# Altium schematic sheet mcu.SchDoc: MCU
size B; Organization: Altium Limited; Address1: L3, 12a Rodborough Rd; Address2: Frenchs Forest; Address3: NSW; Address4: Australia 2086; Revision: A; SheetNumber: 4; SheetTotal: 7
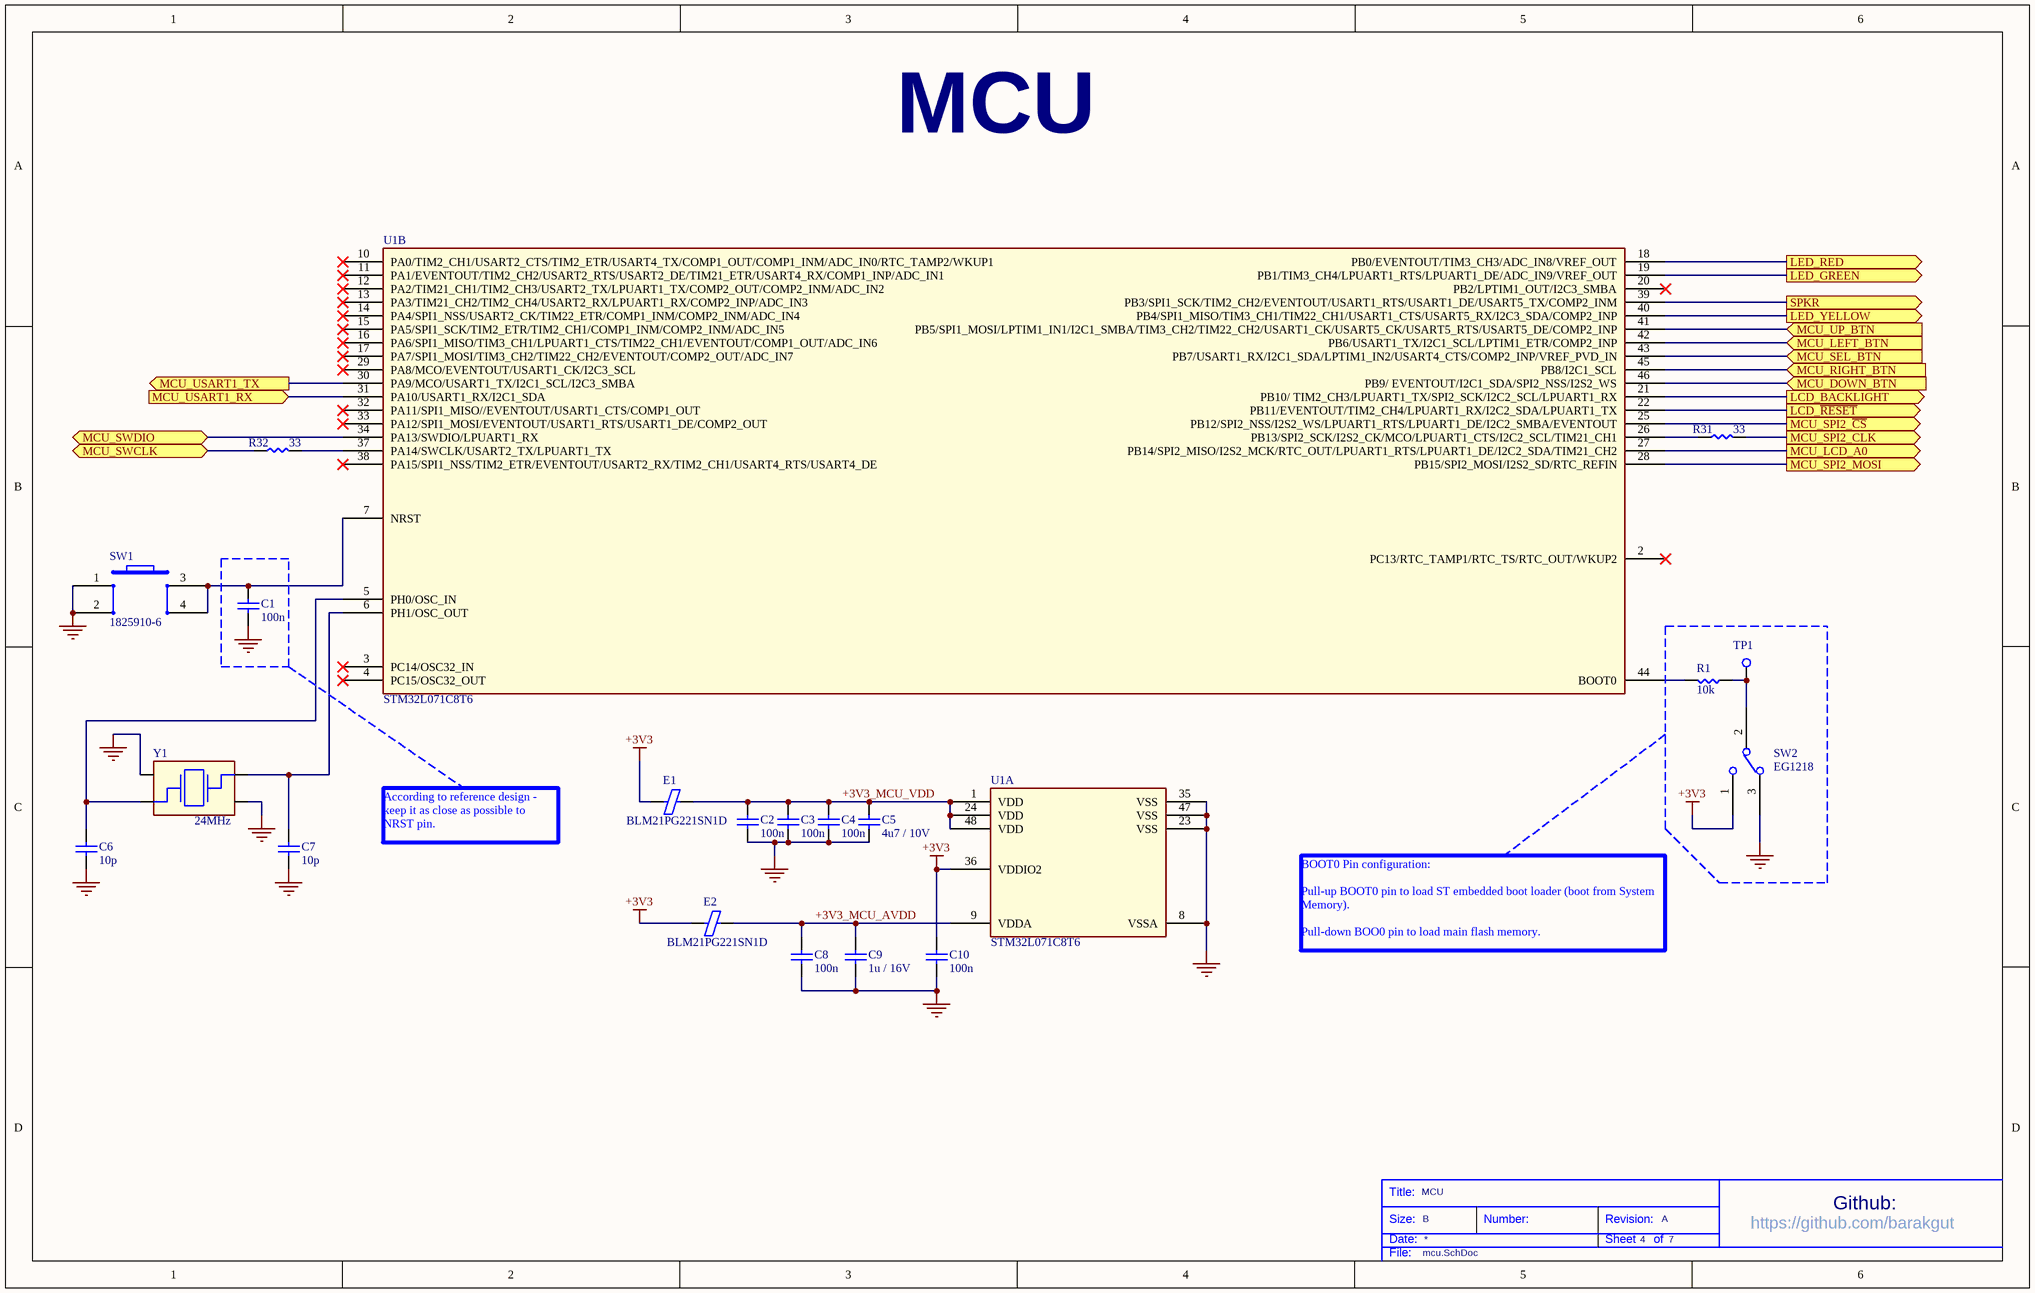
[diagram p0: mcu.SchDoc]

## Parts
C1  100n  [C0402]
C2  100n  [C0402]
C3  100n  [C0402]
C4  100n  [C0402]
C5  4u7 / 10V  [C0805]
C6  10p  [C0402]
C7  10p  [C0402]
C8  100n  [C0402]
C9  1u / 16V  [C0805]
C10  100n  [C0402]
E1  BLM21PG221SN1D  [R0805]
E2  BLM21PG221SN1D  [R0805]
R1  10k  [R0805]
R31  33  [R0402]
R32  33  [R0402]
SW1  1825910-6  [1825910-6]
SW2  EG1218  [EG1218]
TP1  Test Pad 1mm  [TP_1MM]  (value not drawn)  (no BOM)
U1  STM32L071C8T6  [LQFP48]  (parts A,B of 2)
Y1  24MHz  [ABM10AIG-24.000MHZ-4Z-T3]

## Ports
LCD_BACKLIGHT (out), LCD_~{RESET} (out), LED_GREEN (out), LED_RED (out), LED_YELLOW (out), MCU_DOWN_BTN (in), MCU_LCD_A0 (out), MCU_LEFT_BTN (in), MCU_RIGHT_BTN (in), MCU_SEL_BTN (in), MCU_SPI2_CLK (out), MCU_SPI2_MOSI (out), MCU_SPI2_~{CS} (out), MCU_SWCLK (bidir), MCU_SWDIO (bidir), MCU_UP_BTN (in), MCU_USART1_RX (in), MCU_USART1_TX (out), SPKR (out)

## Nets
+3V3: C10.2 E1.1 E2.1 SW2.1 U1.36(VDDIO2)
GND: C1.1 C2.1 C3.1 C4.1 C5.1 C6.1 C7.1 C8.1 C9.1 C10.1 SW1.1 SW1.2 SW2.3 U1.8(VSSA) U1.23(VSS) U1.35(VSS) U1.47(VSS) Y1.2 Y1.4
+3V3_MCU_AVDD: C8.2 C9.2 E2.2 U1.9(VDDA)
+3V3_MCU_VDD: C2.2 C3.2 C4.2 C5.2 E1.2 U1.1(VDD) U1.24(VDD) U1.48(VDD)
LCD_BACKLIGHT: U1.21(PB10/_TIM2_CH3/LPUART1_TX/SPI2_SCK/I2C2_SCL/LPUART1_RX) ; port LCD_BACKLIGHT
LCD_~{RESET}: U1.22(PB11/EVENTOUT/TIM2_CH4/LPUART1_RX/I2C2_SDA/LPUART1_TX) ; port LCD_~{RESET}
LED_GREEN: U1.19(PB1/TIM3_CH4/LPUART1_RTS/LPUART1_DE/ADC_IN9/VREF_OUT) ; port LED_GREEN
LED_RED: U1.18(PB0/EVENTOUT/TIM3_CH3/ADC_IN8/VREF_OUT) ; port LED_RED
LED_YELLOW: U1.40(PB4/SPI1_MISO/TIM3_CH1/TIM22_CH1/USART1_CTS/USART5_RX/I2C3_SDA/COMP2_INP) ; port LED_YELLOW
MCU_DOWN_BTN: U1.46(PB9/_EVENTOUT/I2C1_SDA/SPI2_NSS/I2S2_WS) ; port MCU_DOWN_BTN
MCU_LCD_A0: U1.27(PB14/SPI2_MISO/I2S2_MCK/RTC_OUT/LPUART1_RTS/LPUART1_DE/I2C2_SDA/TIM21_CH2) ; port MCU_LCD_A0
MCU_LEFT_BTN: U1.42(PB6/USART1_TX/I2C1_SCL/LPTIM1_ETR/COMP2_INP) ; port MCU_LEFT_BTN
MCU_RIGHT_BTN: U1.45(PB8/I2C1_SCL) ; port MCU_RIGHT_BTN
MCU_SEL_BTN: U1.43(PB7/USART1_RX/I2C1_SDA/LPTIM1_IN2/USART4_CTS/COMP2_INP/VREF_PVD_IN) ; port MCU_SEL_BTN
MCU_SPI2_~{CS}: U1.25(PB12/SPI2_NSS/I2S2_WS/LPUART1_RTS/LPUART1_DE/I2C2_SMBA/EVENTOUT) ; port MCU_SPI2_~{CS}
MCU_SPI2_CLK: R31.2 ; port MCU_SPI2_CLK
MCU_SPI2_MOSI: U1.28(PB15/SPI2_MOSI/I2S2_SD/RTC_REFIN) ; port MCU_SPI2_MOSI
MCU_SWCLK: R32.1 ; port MCU_SWCLK
MCU_SWDIO: U1.34(PA13/SWDIO/LPUART1_RX) ; port MCU_SWDIO
MCU_UP_BTN: U1.41(PB5/SPI1_MOSI/LPTIM1_IN1/I2C1_SMBA/TIM3_CH2/TIM22_CH2/USART1_CK/USART5_CK/USART5_RTS/USART5_DE/COMP2_INP) ; port MCU_UP_BTN
MCU_USART1_RX: U1.31(PA10/USART1_RX/I2C1_SDA) ; port MCU_USART1_RX
MCU_USART1_TX: U1.30(PA9/MCO/USART1_TX/I2C1_SCL/I2C3_SMBA) ; port MCU_USART1_TX
SPKR: U1.39(PB3/SPI1_SCK/TIM2_CH2/EVENTOUT/USART1_RTS/USART1_DE/USART5_TX/COMP2_INM) ; port SPKR
NetC1_2: C1.2 SW1.3 SW1.4 U1.7(NRST)
NetC6_2: C6.2 U1.5(PH0/OSC_IN) Y1.1
NetC7_2: C7.2 U1.6(PH1/OSC_OUT) Y1.3
NetR1_1: R1.1 SW2.2 TP1.1
NetR1_2: R1.2 U1.44(BOOT0)
NetR31_1: R31.1 U1.26(PB13/SPI2_SCK/I2S2_CK/MCO/LPUART1_CTS/I2C2_SCL/TIM21_CH1)
NetR32_2: R32.2 U1.37(PA14/SWCLK/USART2_TX/LPUART1_TX)

Not connected (* = marked no-connect by the designer): U1 2(PC13/RTC_TAMP1/RTC_TS/RTC_OUT/WKUP2)* 3(PC14/OSC32_IN)* 4(PC15/OSC32_OUT)* 10(PA0/TIM2_CH1/USART2_CTS/TIM2_ETR/USART4_TX/COMP1_OUT/COMP1_INM/ADC_IN0/RTC_TAMP2/WKUP1)* 11(PA1/EVENTOUT/TIM2_CH2/USART2_RTS/USART2_DE/TIM21_ETR/USART4_RX/COMP1_INP/ADC_IN1)* 12(PA2/TIM21_CH1/TIM2_CH3/USART2_TX/LPUART1_TX/COMP2_OUT/COMP2_INM/ADC_IN2)* 13(PA3/TIM21_CH2/TIM2_CH4/USART2_RX/LPUART1_RX/COMP2_INP/ADC_IN3)* 14(PA4/SPI1_NSS/USART2_CK/TIM22_ETR/COMP1_INM/COMP2_INM/ADC_IN4)* 15(PA5/SPI1_SCK/TIM2_ETR/TIM2_CH1/COMP1_INM/COMP2_INM/ADC_IN5)* 16(PA6/SPI1_MISO/TIM3_CH1/LPUART1_CTS/TIM22_CH1/EVENTOUT/COMP1_OUT/ADC_IN6)* 17(PA7/SPI1_MOSI/TIM3_CH2/TIM22_CH2/EVENTOUT/COMP2_OUT/ADC_IN7)* 20(PB2/LPTIM1_OUT/I2C3_SMBA)* 29(PA8/MCO/EVENTOUT/USART1_CK/I2C3_SCL)* 32(PA11/SPI1_MISO//EVENTOUT/USART1_CTS/COMP1_OUT)* 33(PA12/SPI1_MOSI/EVENTOUT/USART1_RTS/USART1_DE/COMP2_OUT)* 38(PA15/SPI1_NSS/TIM2_ETR/EVENTOUT/USART2_RX/TIM2_CH1/USART4_RTS/USART4_DE)*

## Notes on the sheet
- MCU
- According to reference design - keep it as close as possible to NRST pin.
- BOOT0 Pin configuration:
  Pull-up BOOT0 pin to load ST embedded boot loader (boot from System Memory).
  Pull-down BOO0 pin to load main flash memory.
- Title:
- Size:
- Date:
- B
- Number:
- Revision:
- Sheet
- of
- https://github.com/barakgut
- Github:
- File:

## Library data of the parts
C1-C4 C8 C10 = CGA2B3X7R1E104K050BB: TDK         CGA2B3X7R1E104K050BB             SMD Multilayer Ceramic Capacitor, 0402 [1005 Metric], 0.1 F, 25 V,  10%, X7R, CGA Series; PCN Part Number: MLCC Part Number Change 30/Nov/2012; Capacitance: 0.1µF; Product Training Modules: CGA Series for Automotive Applications SEAT, CCV, and TVCL Design Tools Guide to Replacing an Electrolytic Capacitor with an MLCC; Featured Product: CGA Series MLCC Capacitors; Voltage - Rated: 25V; Online Catalog: CGA Series, Automotive General, Mid and High Voltage; Other Names: 445-6902-6; Supplier 1: Digi-Key; Supplier Part Number 1: 445-6902-1-ND; Manufacturer: TDK; Stock 1: 100000; Pricing 1: 1=0.16, 10=0.115, 100=0.054, 500=0.0379, 1000=0.0314, 2500=0.0292, 5000=0.0267 (USD); Package / Case: 0402 (1005 Metric); Packaging: Digi-Reel®; RoHS Information: RoHS Certificate-MLCC; Standard Package: 1; Category: Capacitors; Family: Ceramic Capacitors; Series: CGA; Tolerance: ±10%; Temperature Coefficient: X7R; Mounting Type: Surface Mount, MLCC; Operating Temperature: -55°C ~ 125°C; Applications: Automotive; Ratings: AEC-Q200; Size / Dimension: 0.039" L x 0.020" W (1.00mm x 0.50mm); Height - Seated (Max): -; Thickness (Max): 0.022" (0.55mm); Lead Spacing: -; Features: -; Lead Style: -; ComponentLink1URL: http://www.farnell.com/datasheets/1735392.pdf; ComponentLink1Description: http://www.farnell.com/datasheets/1735392.pdf; ComponentLink2URL: http://www.mouser.com/ds/2/400/lcc_automotive_general_en-843974.pdf; ComponentLink2Description: http://www.mouser.com/ds/2/400/lcc_automotive_general_en-843974.pdf; Manufacturer Part Number: CGA2B3X7R1E104K050BB
C5 = C2012X7R1A475K085AC: 4.7µF ±10% 10V X7R Ceramic Capacitor -55°C ~ 125°C Surface Mount, MLCC 0805 (2012 Metric) 0.079" L x 0.049" W (2.00mm x 1.25mm); Manufacturer: TDK; Product Training Modules: C Series General Applications SEAT, CCV, and TVCL Design Tools Guide to Replacing an Electrolytic Capacitor with an MLCC; EDA / CAD Models: Download from Accelerated Designs; Online Catalog: C Series, General Purpose; Other Names: 445-14527-6; Supplier 1: Digi-Key; Supplier Part Number 1: 445-14527-1-ND; Stock 1: 1; Pricing 1: 1=0.28, 10=0.19, 100=0.1075, 500=0.0759, 1000=0.0664 (USD); RoHS Information: RoHS Certificate-MLCC; Standard Package: 1; Category: Capacitors; Family: Ceramic Capacitors; Series: C; Packaging: Digi-Reel®; Capacitance: 4.7µF; Tolerance: ±10%; Voltage - Rated: 10V; Temperature Coefficient: X7R; Mounting Type: Surface Mount, MLCC; Operating Temperature: -55°C ~ 125°C; Applications: General Purpose; Package / Case: 0805 (2012 Metric); Size / Dimension: 0.079" L x 0.049" W (2.00mm x 1.25mm); Thickness (Max): 0.039" (1.00mm); Manufacturer Part Number: C2012X7R1A475K085AC
C6 C7 = CC0402FRNPO9BN100: Cap Ceramic 10pF 50V C0G 1% SMD 0402 125C Paper T/R; Manufacturer: Yageo; Voltage: 50VDC; Case Style: Ceramic Chip; Wire Form: Not Required; Product Length (mm): 1mm; Product Depth (mm): 0.5mm; Product Diameter (mm): Not Requiredmm; Supplier 1: Digi-Key; Supplier Part Number 1: 311-1640-1-ND; Stock 1: 82755; Pricing 1: 1=0.14, 10=0.104, 100=0.0464, 500=0.0331, 1000=0.026, 2500=0.0237, 5000=0.0218 (USD); Capacitance: 10pF; Tolerance (+ or -): 1%; Temp Coeff (Dielectric): C0G; Operating Temp Range: -55C to 125C; Mounting Style: Surface Mount; Package / Case: 0402; Construction: SMT Chip; Failure Rate: Not Required; Product Height (mm): 0.5mm; Packaging: Tape and Reel; ComponentLink1URL: http://www.yageo.com/documents/recent/UPY-GP_NP0_16V-to-50V_8.pdf; ComponentLink1Description: http://www.yageo.com/documents/recent/UPY-GP_NP0_16V-to-50V_8.pdf; Manufacturer Part Number: CC0402FRNPO9BN100
C9 = C0805C105K4RAC7800: Multilayer Ceramic Capacitors MLCC - SMD/SMT 16volts 1uF X7R 10%; Manufacturer: KEMET; Rad Hard: No; Voltage: 16 Vdc; Product Length: 2 mm; Product Height: 0.9 mm; Product Depth: 1.25 mm; Supplier 1: Digi-Key; Supplier Part Number 1: 399-1284-1-ND; Stock 1: 40000; Pricing 1: 1=0.17, 10=0.124, 100=0.0581, 500=0.0408, 1000=0.0337 (USD); Package/Case: 0805; Mounting: Surface Mount; Capacitance Value: 1 uF; Tolerance: 10 %; Dielectric: X7R; Operating Temperature: -55 to 125 °C; Construction: Flat; Category: Capacitor Ceramic Multilayer; Manufacturer Part Number: C0805C105K4RAC7800
E1 E2 = BLM21PG221SN1D: FERRITE CHIP 220 OHM 0805; Manufacturer: Murata; Product Training Modules: Ferrite Beads and Arrays; Catalog Drawings: BLM21 Series Side BLM21 Series Top; EDA / CAD Models: Download from Accelerated Designs; Filter Type: Power Line; Number of Lines: 1; Impedance @ Frequency: 220 Ohm @ 100MHz; Current Rating (Max): 2A; DC Resistance (DCR) (Max): 45 mOhm; Online Catalog: EMIFIL® BLM21P Series; Other Names: 490-1054-6; Supplier 1: Digi-Key; Supplier Part Number 1: 490-1054-1-ND; Stock 1: 1796179; Pricing 1: 1=0.1, 10=0.081, 25=0.0732, 50=0.0538, 100=0.0464, 250=0.0366, 500=0.0309, 1000=0.0261 (USD); Standard Package: 1; Category: Filters; Family: Ferrite Beads and Chips; Series: BLM21P; Packaging: Digi-Reel®; Ratings: -; Operating Temperature: -55°C ~ 125°C; Package / Case: 0805 (2012 Metric); Mounting Type: Surface Mount; Height (Max): 0.041" (1.05mm); Size / Dimension: 0.079" L x 0.049" W (2.00mm x 1.25mm); Manufacturer Part Number: BLM21PG221SN1D
R1 = RC0805FR-0710KL: RES SMD 10K OHM 1% 1/8W 0805; Manufacturer: Yageo; Resistance: 10 kOhms; Power Rating: 125 mW (1/8 W); Voltage Rating: 150 V; Temperature Coefficient: 100 PPM / C; Supplier 1: Digi-Key; Supplier Part Number 1: 311-10.0KCRCT-ND; Stock 1: 31531286; Pricing 1: 1=0.1, 10=0.046, 100=0.0186, 1000=0.0084, 2500=0.0073 (USD); Termination Style: SMD/SMT; Product: Thick Film Resistors General Purpose; Tolerance: 1 %; Case Code - in: 0805; Case Code - mm: 2012; Series: RC; Operating Temperature Range: - 55 C to + 155 C; Packaging: Reel; Manufacturer Part Number: RC0805FR-0710KL
R31 R32 = RC0402FR-0733RL: YAGEO (PHYCOMP)         RC0402FR-0733RL             SMD Chip Resistor, Thick Film, 33 ohm, 50 V, 0402 [1005 Metric], 62.5 mW,  1%, RC Series; Resistance: 33ohm; Voltage Rating: 50V; Power Rating: 62.5mW; Temperature Coefficient: ± 100ppm/°C; SVHC: To Be Advised; Supplier 1: Digi-Key; Supplier Part Number 1: 311-33.0LRCT-ND; Manufacturer: Yageo; Stock 1: 10530829; Pricing 1: 1=0.1, 10=0.018, 100=0.0073, 1000=0.0033, 2500=0.0029, 5000=0.0024 (USD); Product Range: RC Series; Resistor Case Style: 0402 [1005 Metric]; Resistance Tolerance: ± 1%; Packaging: Cut Tape; Resistor Element Type: Thick Film; MSL: MSL 1 - Unlimited; ComponentLink1URL: https://www.verical.com/server-webapp/html/getDatasheet?partID=329253; ComponentLink1Description: https://www.verical.com/server-webapp/html/getDatasheet?partID=329253; ComponentLink2URL: http://www.yageo.com/documents/recent/PYu-RC_Group_51_RoHS_L_9.pdf; ComponentLink2Description: http://www.yageo.com/documents/recent/PYu-RC_Group_51_RoHS_L_9.pdf; ComponentLink3URL: http://www.farnell.com/datasheets/1018594.pdf; ComponentLink3Description: http://www.farnell.com/datasheets/1018594.pdf; ComponentLink4URL: http://documents.rs-components.com/techlib://itc_doclist_GB.htm?stockno=6186734; ComponentLink4Description: http://documents.rs-components.com/techlib://itc_doclist_GB.htm?stockno=6186734; ComponentLink5URL: http://www.yageo.com/documents/recent/PYu-RC0402_51_RoHS_L_6_r.pdf; ComponentLink5Description: http://www.yageo.com/documents/recent/PYu-RC0402_51_RoHS_L_6_r.pdf; Manufacturer Part Number: RC0402FR-0733RL
SW1 = 1825910-6: Switch Push Button OFF (ON) SPST Round Button 0.05A 24VDC Momentary Contact PC Pins Thru-Hole; Manufacturer: TE Connectivity Alcoswitch; Actuator Color: Black; Actuator Length: 1.4 mm; Actuator Material: Polybutylene Terephthalate; Body Orientation: Straight; Bushing Type: Unthreaded; Electrical Life: 100000 Cycles; Dielectric Strength: 500 VAC; Contact Rating @ Voltage: 0.05A@24VDC; Maximum DC Voltage Rating: 24 V; Maximum Contact Resistance: 100 mOhm; Illumination: N/R; Supplier 1: Digi-Key; Supplier Part Number 1: 450-1650-ND; Stock 1: 75696; Pricing 1: 1=0.1, 10=0.093, 25=0.0892, 50=0.0862, 100=0.0814, 250=0.0766, 500=0.0734, 1000=0.0558, 5000=0.0463 (USD); Base Material: N/A; Actuator Style: Round Button; Family: 1825910; Contact Material: Copper Alloy; Contact Plating: Silver; Dimension: 5.99 x 5 mm; Part No: 1825910-6; RoHS: Yes; Function: Momentary Contact; Maximum AC Voltage Rating: N/A; Pole Throw Configuration: SPST; Mechanical Life: 100000 Cycles; Packaging: N/A; Housing Material: N/A; Product Weight: N/A; Mounting: Through Hole; Minimum Insulation Resistance: 100 MOhm; Operating Temperature: -35 to 85 C; Terminal Type: PC Pins; Seal Description: N/A; Switch Configuration: OFF (ON); Seal Location: N/A; Thread Size: N/R; Manufacturer Part Number: 1825910-6
SW2 = EG1218: E-SWITCH         EG1218             SLIDE SWITCH, SPDT, 200MA; Product Training Modules: Switch Basics Power Switch Overview; 3D Model: EG1218.stp; Contact Timing: Non-Shorting (BBM); Switch Function: On-On; Current Rating: 200mA (DC); Voltage Rating - DC: 30V; Actuator Type: Standard; Actuator Length: 2.00mm; Switch Travel: 2.50mm; Operating Force: 250gf; Online Catalog: EG Series; Other Names: EG1903 P040040; Supplier 1: Digi-Key; Supplier Part Number 1: EG1903-ND; Manufacturer: E-Switch; Stock 1: 39243; Pricing 1: 1=0.58, 10=0.559, 25=0.5472, 50=0.4888, 100=0.4656, 250=0.454, 500=0.3841, 1000=0.3725, 5000=0.3259 (USD); Catalog Drawings: EG1218; Standard Package: 1,000; Category: Switches; Family: Slide Switches; Series: EG; Packaging: Bulk; Circuit: SPDT; Voltage Rating - AC: -; Contact Material: Copper Alloy; Contact Finish: Silver; Mounting Type: Through Hole; Termination Style: PC Pin; Features: -; Actuator Material: -; Operating Temperature: -20°C ~ 70°C; Mechanical Life: -; Electrical Life: -; Manufacturer Part Number: EG1218
TP1 = TEST_PAD_1mm
U1 = STM32L071C8T6: ARM® Cortex®-M0+ STM32L0 Microcontroller IC 32-Bit 32MHz 64KB (64K x 8) FLASH 48-LQFP (7x7); Manufacturer: STMicroelectronics; Supplier 1: Digi-Key; Supplier Part Number 1: 497-17496-ND; Stock 1: 1883; Pricing 1: 1=3.15, 10=2.827, 100=2.3166, 500=1.9721, 1000=1.6632 (USD); Manufacturer Part Number: STM32L071C8T6
Y1 = ABM10AIG24.000MHZ4ZT3: Manufacturer: Abracon; Supplier 1: Digi-Key; Supplier Part Number 1: 535-13363-1-ND; Stock 1: 0; Manufacturer Part Number: ABM10AIG24.000MHZ4ZT3